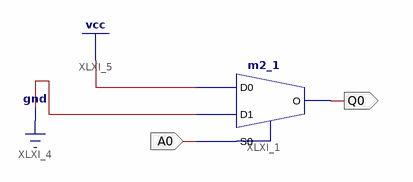
[diagram p0: schematic sheet 1]
// Xilinx ISE schematic Lab03_dwe.sch (spartan3) as structural Verilog: 1 symbols, 2 ports
module Lab03_dwe (
  input  A0,
  output Q0
);

  m2_1 XLXI_1 (.D0(1'b1), .D1(1'b0), .S0(A0), .O(Q0));
endmodule
